# EAGLE design rc-light-controller-ws2812-12f1840 (EAGLE 6.5.0)
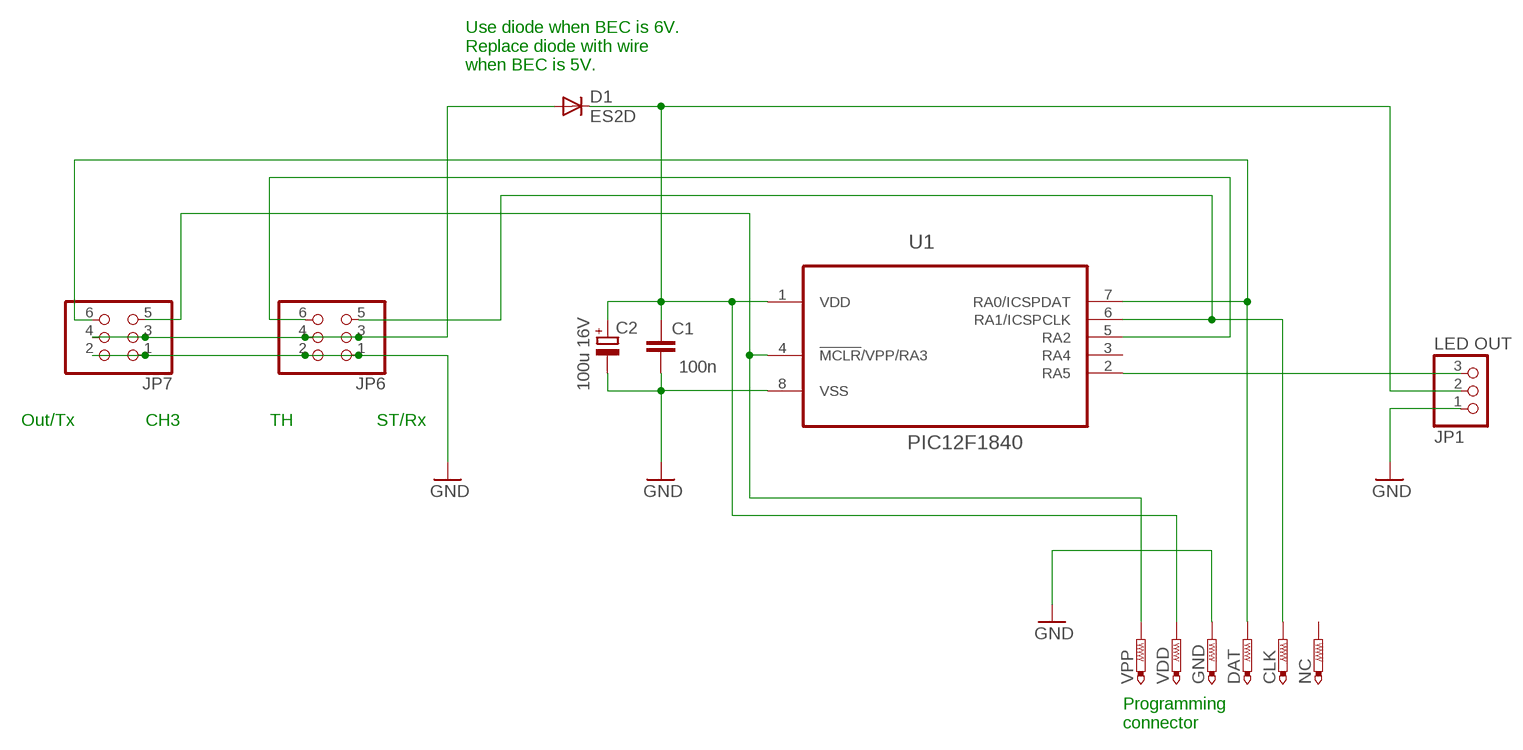
[diagram p0: schematic, sheet 1]

## Parts
C1  100n  C-EUC0805K  [C0805K]
C2  100u 16V  CPOL-EU153CLV-0605  [153CLV-0605]
CLK  PTR1TP14R  [TP14R]
D1  ES2D  [SMB]
DAT  PTR1TP14R  [TP14R]
GND  PTR1TP14R  [TP14R]
JP1  LED OUT  PINHD-1X3  [1X03]
JP6  PINHD-2X3  [2X03]
JP7  PINHD-2X3  [2X03]
NC  PTR1TP14R  [TP14R]
U1  12F1840  PIC12F1840-E/SN  [SOIC127P600X175-8N]
VDD  PTR1TP14R  [TP14R]
VPP  PTR1TP14SQ  [TP14SQ]

## Nets
CH3: JP7.5 U1.4(!MCLR!/VPP/RA3) VPP.TP
GND: C1.2 C2.- GND.TP JP1.1 JP6.1 JP6.2 JP7.1 JP7.2 U1.8(VSS)
N$6: JP1.3 U1.2(RA5)
OUT/TX: DAT.TP JP7.6 U1.7(RA0/ICSPDAT)
ST/RX: CLK.TP JP6.5 U1.6(RA1/ICSPCLK)
TH: JP6.6 U1.5(RA2)
VBAT: D1.A JP6.3 JP6.4 JP7.3 JP7.4
VDD: C1.1 C2.+ D1.C JP1.2 U1.1(VDD) VDD.TP
Unconnected: NC.TP U1.3(RA4)

## Notes on the sheet
- Use diode when BEC is 6V.
  Replace diode with wire 
  when BEC is 5V.
- Out/Tx | CH3 | TH | ST/Rx
- Programming
  connector

## Library data of the parts
C1 = rcl:C-EU: CAPACITOR, European symbol
C2 = rcl:CPOL-EU: POLARIZED CAPACITOR, European symbol
CLK DAT GND NC VDD VPP = testpad:PTR1: TEST PIN
D1 = diode:ES2D: DIODE super fast rectifier, 2 A
JP1 = pinhead:PINHD-1X3: PIN HEADER
JP6 JP7 = pinhead:PINHD-2X3: PIN HEADER
U1 = PIC12F1840:PIC12F1840-E/SN: IC, MCU, 8BIT, 7K FLASH, 8SOIC; MPN: PIC12F1840-E/SN; OC_FARNELL: 2045290; OC_NEWARK: 13T4704; PACKAGE: SOIC-8; SUPPLIER: Microchip

## Board
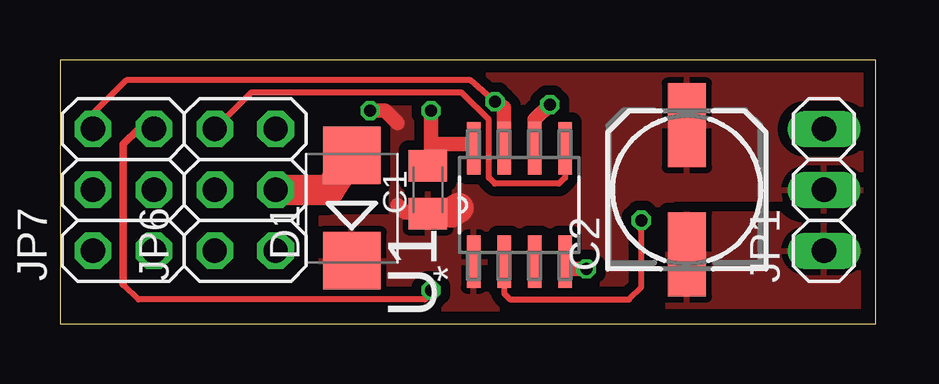
[diagram p1: board, top side]
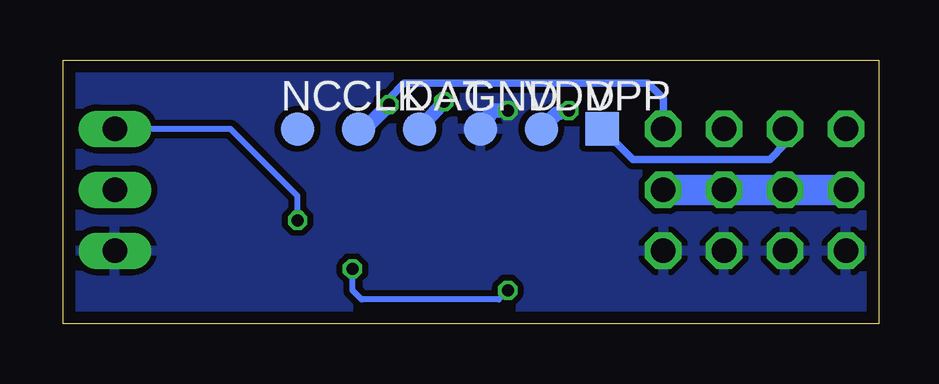
[diagram p2: board, bottom side, seen from below]

Size 34 x 11 mm. Coordinates in mm from the lower left corner, seen from the top.
Outline: 0,0 34,0 34,11 0,11 0,0
Copper layers (1*16): Top 0.035mm / dielectric 1.5mm / Bottom 0.035mm
Design rules "smart-prototyping": minimum track width 7mil, minimum drill 12mil, track to track 7mil, track to pad 7mil, pad to pad 7mil, via to via 7mil, smd to smd 0mil, copper to edge 20mil, drill to drill 10mil, minimum pad ring 10mil, minimum via ring 6mil, stop-mask expansion 2mil, vias tented up to drill 25mil, thermal gap 10mil

### Footprints (pad centres in the part's own frame; a part is rotated, then mirrored left to right if it is on the bottom)
C0805K = smd 1.3 x 1.6: 1 -1,0; 2 1,0
153CLV-0605 = smd 3.5 x 1.6: + 2.7,0; - -2.7,0
TP14R = smd 1.4 x 1.4: TP 0,0
SMB = smd 2.4 x 2.4: A 2.2,0; C -2.2,0
1X03 = drill 1.016 long: 1 -2.54,0; 2 0,0; 3 2.54,0
2X03 = drill 1.016 octagon: 1 -2.54,-1.27; 2 -2.54,1.27; 3 0,-1.27; 4 0,1.27; 5 2.54,-1.27; 6 2.54,1.27
SOIC127P600X175-8N = smd 2.184 x 0.559: 1 -2.362,1.905; 2 -2.362,0.635; 3 -2.362,-0.635; 4 -2.362,-1.905; 5 2.362,-1.905; 6 2.362,-0.635; 7 2.362,0.635; 8 2.362,1.905
TP14SQ = smd 1.4 x 1.4: TP 0,0

### Placement (x,y rotation side)
C1  15.34,5.58 90 top
C2  26.14,5.58 90 top
CLK  21.69,8.12 0 bottom
D1  12.16,4.82 90 top
DAT  19.15,8.12 0 bottom
GND  16.61,8.12 0 bottom
JP1  31.85,5.58 90 top
JP6  7.72,5.58 90 top
JP7  2.64,5.58 90 top
NC  24.23,8.12 0 bottom
U1  19.15,4.95 90 top
VDD  14.07,8.12 0 bottom
VPP  11.53,8.12 0 bottom

### Tracks (layer width: path | path; a pad name or v marks a point on that pad's centre or on a via)
CH3  (via drill 0.5)
  Top 0.254: 2.64,1.64 3.27,1.01 15.21,1.01 15.47,1.26 v15.47,1.39
  Top 0.305: 2.64,1.64 2.64,7.49 3.27,8.12 JP7.5
  Top 0.61: v21.94,2.28 21.36,2.28 U1.4
  Bottom 0.254: v15.47,1.39 15.85,1.01 21.56,1.01 21.94,1.39 v21.94,2.28
  Bottom 0.305: JP7.5 3.91,7.49 4.54,6.85 10.26,6.85 VPP.TP
GND  (via drill 0.5)
  Top 0.61: v15.47,8.88 15.47,7.49 | 15.47,7.49 15.47,6.58 C1.2 | U1.8 17.25,7.49 15.47,7.49
  Bottom 0.61: GND.TP 16.1,8.88 v15.47,8.88
  pour Bottom (isolate 0.254): 0.1,10.66 0.1,0.5 33.76,0.5 33.76,10.66
  pour Top (isolate 0.61): 33.76,0.5 25.37,0.5 25.37,4.56 33.76,4.56
N$6  (via drill 0.5)
  Top 0.254: U1.2 18.52,1.26 18.77,1.01 23.72,1.01 24.23,1.52 v24.23,4.31
  Bottom 0.254: v24.23,4.31 24.23,5.33 27.02,8.12 JP1.3
OUT/TX  (via drill 0.5)
  Top 0.254: JP7.6 1.37,8.76 2.77,10.15 17.12,10.15 v18.13,9.26
  Top 0.61: U1.7 18.52,9.01 v18.13,9.26
  Bottom 0.61: DAT.TP v18.13,9.26
ST/RX  (via drill 0.5)
  Top 0.61: U1.6 19.79,8.5 v20.42,9.14
  Bottom 0.305: JP6.5 8.99,9.39 9.62,10.03 19.79,10.03 20.42,9.39 v20.42,9.14
  Bottom 0.61: CLK.TP 21.44,8.12 v20.42,9.14
TH
  Top 0.254: U1.5 21.05,6.09 20.8,5.83 18.13,5.83 17.88,6.09 17.88,8.5 16.74,9.64 7.97,9.64 JP6.6
VBAT
  Top 1.27: JP6.3 11.23,5.58 D1.A
  Bottom 1.27: JP7.4 JP7.3 JP6.4 JP6.3
VDD  (via drill 0.5)
  Top 0.61: 16.29,4.63 14.39,4.63 14.07,4.95 | 14.07,8.37 13.56,8.88 v12.93,8.88
  Top 1.27: 16.61,4.82 16.29,4.63
  Bottom 0.61: v12.93,8.88 13.44,8.76 VDD.TP
  pour Top (isolate 0.406, rank 2): 10.89,0.5 33.76,0.5 33.76,10.66 13.82,10.66 13.82,4.44 10.89,4.44

### Text on the board
tValues: Servo / Tx | CH3 | TH | ST/Rx | + | Data | + | * | - | GND | GND
bValues: LED OUT | Servo / Tx | CH3 | TH | ST/Rx | Vpp | Data | + | WS2812 RC Light controller | Rev 1 | + | LANE Boys RC | GND | GND
_tNames: C2 | C1 | D1 | JP2 | JP1 | U1
_bNames: VPP | VDD | GND | DAT | CLK | NC